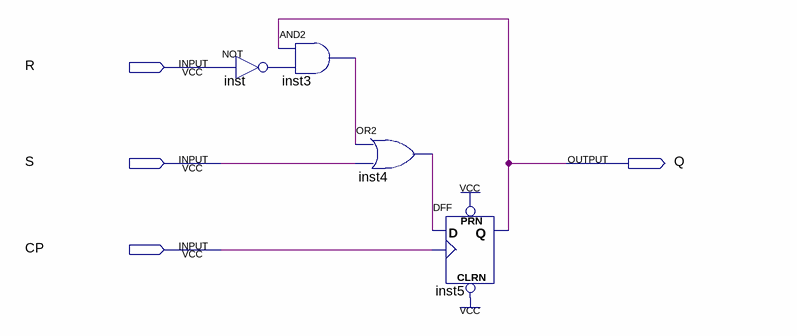
[diagram p0: schematic sheet]
// Quartus schematic problem1.bdf as structural Verilog: 4 symbols, 4 pins
module problem1 (
  input  R,
  input  S,
  input  CP,
  output Q
);

  wire inst3_out, inst4_out, inst_out;

  not inst (inst_out, R);
  and inst3 (inst3_out, Q, inst_out);
  or inst4 (inst4_out, inst3_out, S);
  DFF inst5 (.CLRN(1'b1), .CLK(CP), .D(inst4_out), .PRN(1'b1), .Q(Q));
endmodule
